# EAGLE design SD Card - Battery Board (EAGLE 6.4)

## Sheet 1 of 3: SD Card Connection
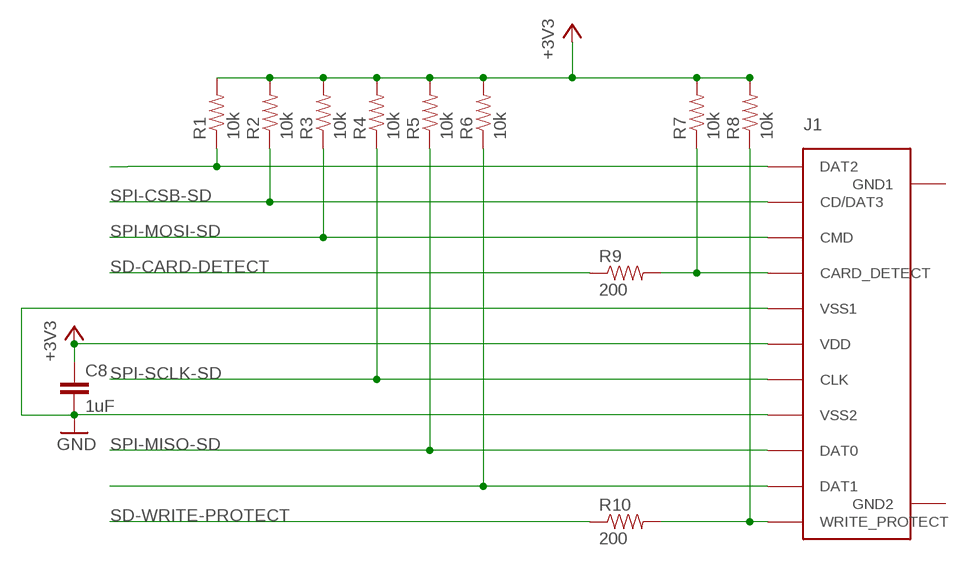
[diagram p0: schematic, sheet 1]

### Parts
C8  1uF  CAPACITOR1U-X5R-10%-10V  [C0402]
J1  SD_CARD_SLOT  [693061010911]
R1  10k  RESISTOR10K-100M-0.5%-75V  [R0603]
R2  10k  RESISTOR10K-100M-0.5%-75V  [R0603]
R3  10k  RESISTOR10K-100M-0.5%-75V  [R0603]
R4  10k  RESISTOR10K-100M-0.5%-75V  [R0603]
R5  10k  RESISTOR10K-100M-0.5%-75V  [R0603]
R6  10k  RESISTOR10K-100M-0.5%-75V  [R0603]
R7  10k  RESISTOR10K-100M-0.5%-75V  [R0603]
R8  10k  RESISTOR10K-100M-0.5%-75V  [R0603]
R9  200  RESISTOR200-100M-0.1%-75V  [R0603]
R10  200  RESISTOR200-100M-0.1%-75V  [R0603]

### Nets
+3V3: C8.1 J1.P$4(VDD) R1.2 R2.2 R3.2 R4.2 R5.2 R6.2 R7.2 R8.2 ; also sheet 2
GND: C8.2 J1.P$3(VSS1) J1.P$6(VSS2) ; also sheet 2,3
N$16: J1.P$9(DAT2) R1.1
N$19: J1.P$10(CARD_DETECT) R7.1 R9.2
N$25: J1.P$8(DAT1) R6.1
N$26: J1.P$11(WRITE_PROTECT) R8.1 R10.2
SD-CARD-DETECT: R9.1
SD-WRITE-PROTECT: R10.1
SPI-CSB-SD: J1.P$1(CD/DAT3) R2.1
SPI-MISO-SD: J1.P$7(DAT0) R5.1 ; also sheet 3
SPI-MOSI-SD: J1.P$2(CMD) R3.1 ; also sheet 3
SPI-SCLK-SD: J1.P$5(CLK) R4.1 ; also sheet 3
Unconnected: J1.P$12(GND1) J1.P$13(GND2)

## Sheet 2 of 3: Battery Monitoring
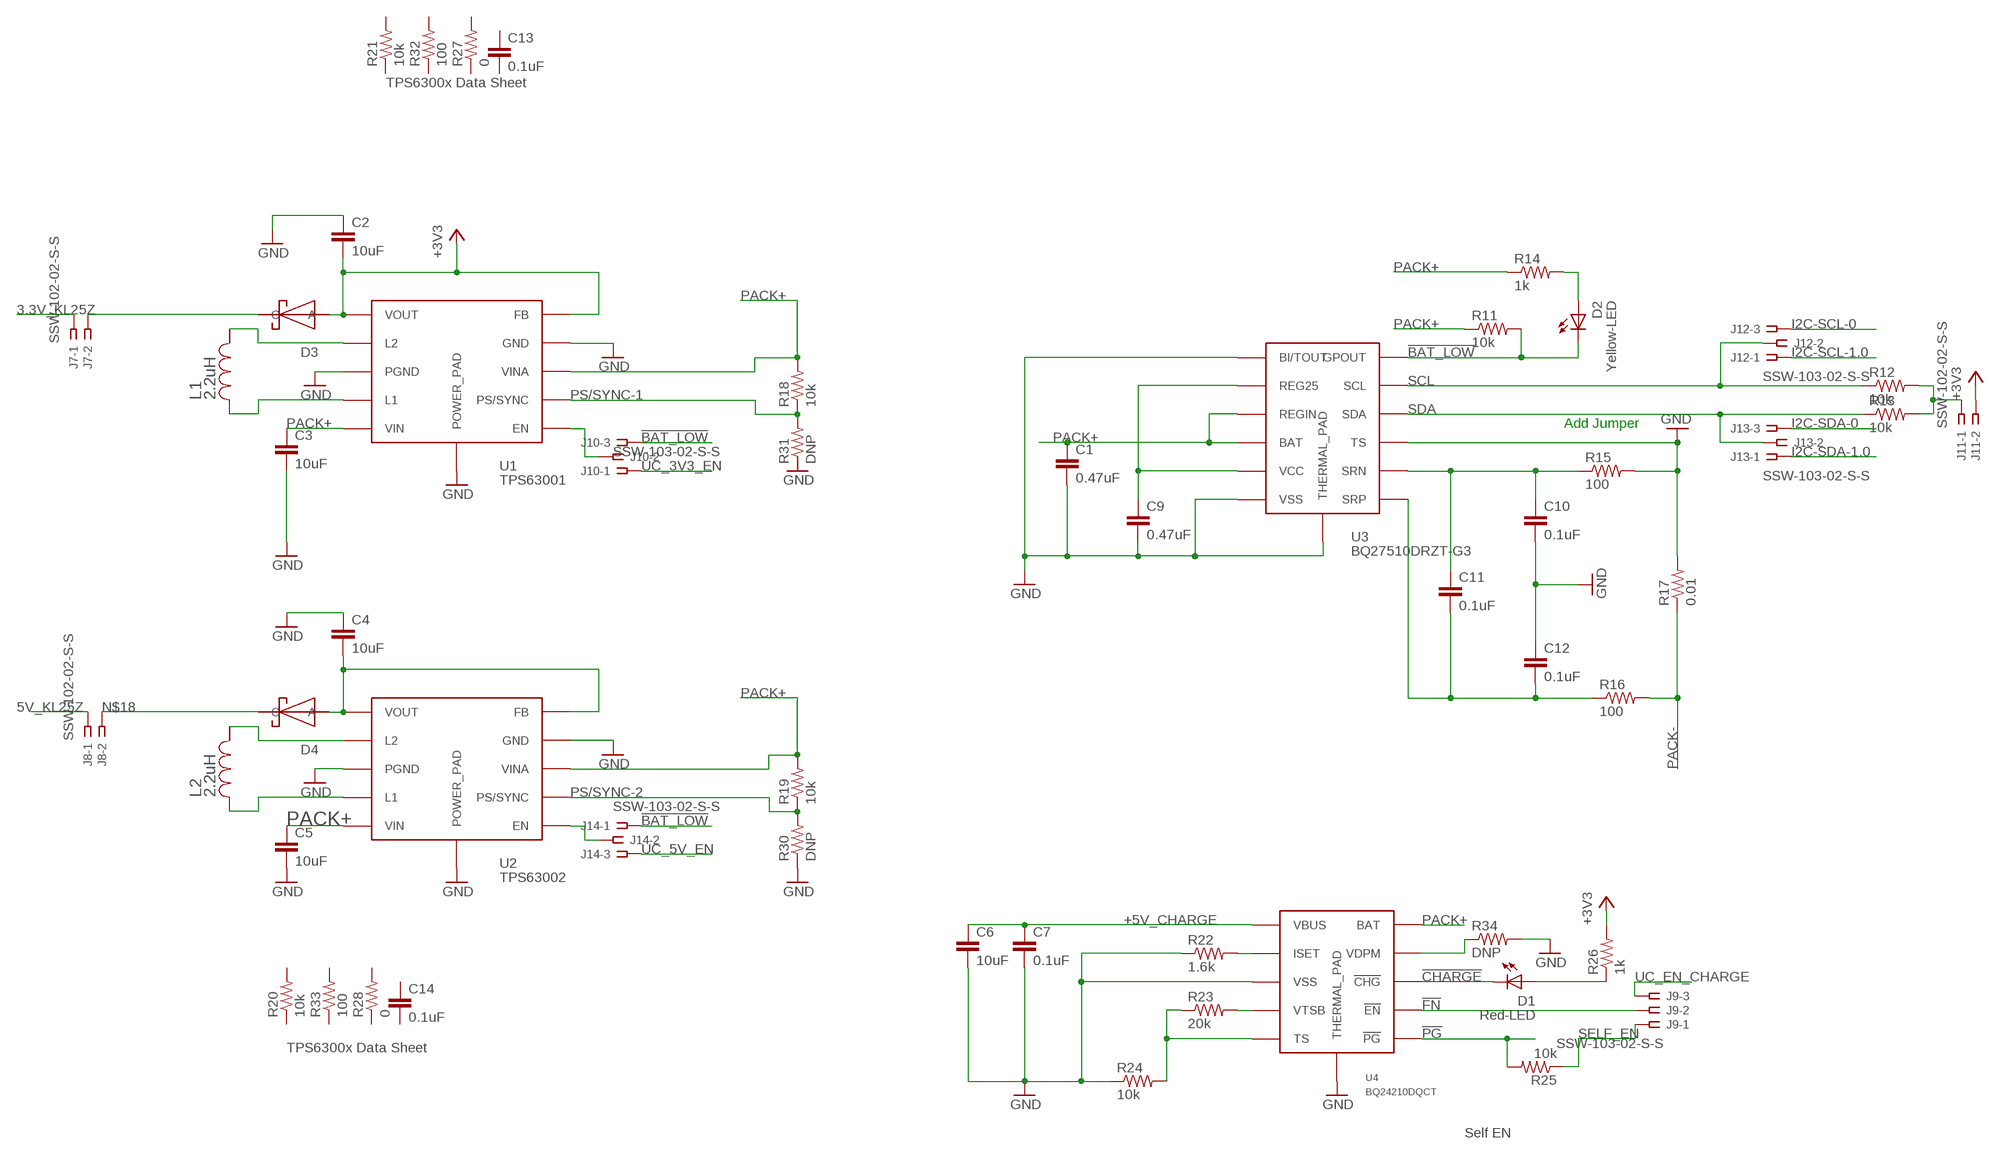
[diagram p1: schematic, sheet 2]

### Parts
C1  0.47uF  CAPACITOR0.47U-X5R-10%-6.3V-0402  [C0402]
C2  10uF  CAPACITOR10U-X5R-20%-6.3V-0402  [C0402]
C3  10uF  CAPACITOR10U-X5R-20%-6.3V-0402  [C0402]
C4  10uF  CAPACITOR10U-X5R-20%-6.3V-0402  [C0402]
C5  10uF  CAPACITOR10U-X5R-20%-6.3V-0402  [C0402]
C6  10uF  CAPACITOR10U-X5R-20%-6.3V-0402  [C0402]
C7  0.1uF  CAPACITOR0.1U-X7R-10%-25V  [C0402]
C9  0.47uF  CAPACITOR0.47U-X5R-10%-6.3V-0402  [C0402]
C10  0.1uF  CAPACITOR0.1-X5R-10%-16V-0402  [C0402]
C11  0.1uF  CAPACITOR0.1-X5R-10%-16V-0402  [C0402]
C12  0.1uF  CAPACITOR0.1-X5R-10%-16V-0402  [C0402]
C13  0.1uF  CAPACITOR0.1U-X7R-10%-25V  [C0402]
C14  0.1uF  CAPACITOR0.1U-X7R-10%-25V  [C0402]
D1  Red-LED  0.8X1.2BLUE-3.3V-20M  [0.8X1.2]
D2  Yellow-LED  0.8X1.2GREEN-3.3V-20M  [0.8X1.2]
D3  SCHOTTKY  [SC-90]
D4  SCHOTTKY  [SC-90]
J7  SSW-102-02-S-S  [SSW-102-02-S-S]
J8  SSW-102-02-S-S  [SSW-102-02-S-S]
J9  SSW-103-02-S-S  [SSW-103-02-S-S]
J10  SSW-103-02-S-S  [SSW-103-02-S-S]
J11  SSW-102-02-S-S  [SSW-102-02-S-S]
J12  SSW-103-02-S-S  [SSW-103-02-S-S]
J13  SSW-103-02-S-S  [SSW-103-02-S-S]
J14  SSW-103-02-S-S  [SSW-103-02-S-S]
L1  2.2uH  TY0NRS4010T2R2MDGG  [NRS401X]
L2  2.2uH  TY0NRS4010T2R2MDGG  [NRS401X]
R11  10k  RESISTOR10K-62.5M-1%-50V  [R0402]
R12  10k  RESISTOR10K-62.5M-1%-50V  [R0402]
R13  10k  RESISTOR10K-62.5M-1%-50V  [R0402]
R14  1k  RESISTOR1K-63M-1%-50V-0402  [R0402]
R15  100  RESISTOR1K-63M-1%-50V-0402  [R0402]
R16  100  RESISTOR1K-63M-1%-50V-0402  [R0402]
R17  0.01  RESISTOR0.01-100M-1%-50V  [R0603]
R18  10k  RESISTOR10K-62.5M-1%-50V  [R0402]
R19  10k  RESISTOR10K-62.5M-1%-50V  [R0402]
R20  10k  RESISTOR10K-62.5M-1%-50V  [R0402]
R21  10k  RESISTOR10K-62.5M-1%-50V  [R0402]
R22  1.6k  RESISTOR1.6K-63M-1%-50V-0402  [R0402]
R23  20k  RESISTOR20K-63M-1%-50V-0402  [R0402]
R24  10k  RESISTOR10K-62.5M-1%-50V  [R0402]
R25  10k  RESISTOR10K-62.5M-1%-50V  [R0402]
R26  1k  RESISTOR1K-63M-1%-50V-0402  [R0402]
R27  0  RESISTOR0-100M-X%-50V  [R0402]
R28  0  RESISTOR0-100M-X%-50V  [R0402]
R30  DNP  RESISTOR0402  [R0402]
R31  DNP  RESISTOR0402  [R0402]
R32  100  RESISTOR1K-63M-1%-50V-0402  [R0402]
R33  100  RESISTOR1K-63M-1%-50V-0402  [R0402]
R34  DNP  RESISTOR0402  [R0402]
U1  TPS63001  TPS6300XTPS63001  [VFDFN-10]
U2  TPS63002  TPS6300XTPS63002  [VFDFN-10]
U3  BQ27510DRZT-G3  BQ27510-G3  [VFDFN-12]
U4  BQ24210DQCT  B224210  [WFDFN-10]

### Nets
3.3V_KL25Z: J7.1 ; also sheet 3
5V_KL25Z: J8.1 ; also sheet 3
!BAT_LOW: D2.P$2(C) J10.3 J14.1 R11.2 U3.P$12(GPOUT)
!CHARGE: D1.P$2(C) U4.P$8(!CHG)
!FN: J9.2 U4.P$7(!EN)
!PG: R25.2 U4.P$6(!PG)
+3V3: C2.2 D3.P$2(A) J11.2 R26.2 U1.P$1(VOUT) U1.P$10(FB) ; also sheet 1
+5V_CHARGE: C6.1 C7.1 U4.P$1(VBUS) ; also sheet 3
GND: C1.2 C2.1 C3.2 C4.1 C5.2 C6.2 C7.2 C9.2 C10.2 C12.1 R15.2 R17.2 R22.1 R24.1 R30.1 R31.1 R34.2 U1.P$3(PGND) U1.P$9(GND) U1.P$11(POWER_PAD) U2.P$3(PGND) U2.P$9(GND) U2.P$11(POWER_PAD) U3.P$1(BI/TOUT) U3.P$6(VSS) U3.P$9(TS) U3.P$13(THERMAL_PAD) U4.P$3(VSS) U4.P$11(THERMAL_PAD) ; also sheet 1,3
I2C-SCL-0: J12.3 ; also sheet 3
I2C-SCL-1.0: J12.1 ; also sheet 3
I2C-SDA-0: J13.3 ; also sheet 3
I2C-SDA-1.0: J13.1 ; also sheet 3
N$1: C9.1 U3.P$2(REG25) U3.P$5(VCC)
N$2: J10.2 U1.P$6(EN)
N$3: R34.1 U4.P$9(VDPM)
N$4: J11.1 R12.2 R13.2
N$5: D2.P$1(A) R14.2
N$6: C11.2 C12.2 R16.1 U3.P$7(SRP)
N$7: C10.1 C11.1 R15.1 U3.P$8(SRN)
N$8: L1.P$1 U1.P$2(L2)
N$9: L1.P$2 U1.P$4(L1)
N$10: D1.P$1(A) R26.1
N$13: J14.2 U2.P$6(EN)
N$14: L2.P$1 U2.P$2(L2)
N$15: L2.P$2 U2.P$4(L1)
N$17: D3.P$1(C) J7.2
N$18: D4.P$1(C) J8.2
N$20: C4.2 D4.P$2(A) U2.P$1(VOUT) U2.P$10(FB)
N$31: R22.2 U4.P$2(ISET)
N$32: R23.2 U4.P$4(VTSB)
N$33: R23.1 R24.2 U4.P$5(TS)
PACK+: C1.1 C3.1 C5.1 R11.1 R14.1 R18.2 R19.2 U1.P$5(VIN) U1.P$8(VINA) U2.P$5(VIN) U2.P$8(VINA) U3.P$3(REGIN) U3.P$4(BAT) U4.P$10(BAT) ; also sheet 3
PACK-: R16.2 R17.1 ; also sheet 3
PS/SYNC-1: R18.1 R31.2 U1.P$7(PS/SYNC)
PS/SYNC-2: R19.1 R30.2 U2.P$7(PS/SYNC)
SCL: J12.2 R12.1 U3.P$11(SCL)
SDA: J13.2 R13.1 U3.P$10(SDA)
SELF_EN: J9.1 R25.1
UC_3V3_EN: J10.1
UC_5V_EN: J14.3
UC_EN_CHARGE: J9.3
Unconnected: C13.1 C13.2 C14.1 C14.2 R20.1 R20.2 R21.1 R21.2 R27.1 R27.2 R28.1 R28.2 R32.1 R32.2 R33.1 R33.2

### Notes on the sheet
- TPS6300x Data Sheet
- Add Jumper
- TPS6300x Data Sheet
- Self EN

## Sheet 3 of 3: Connectors
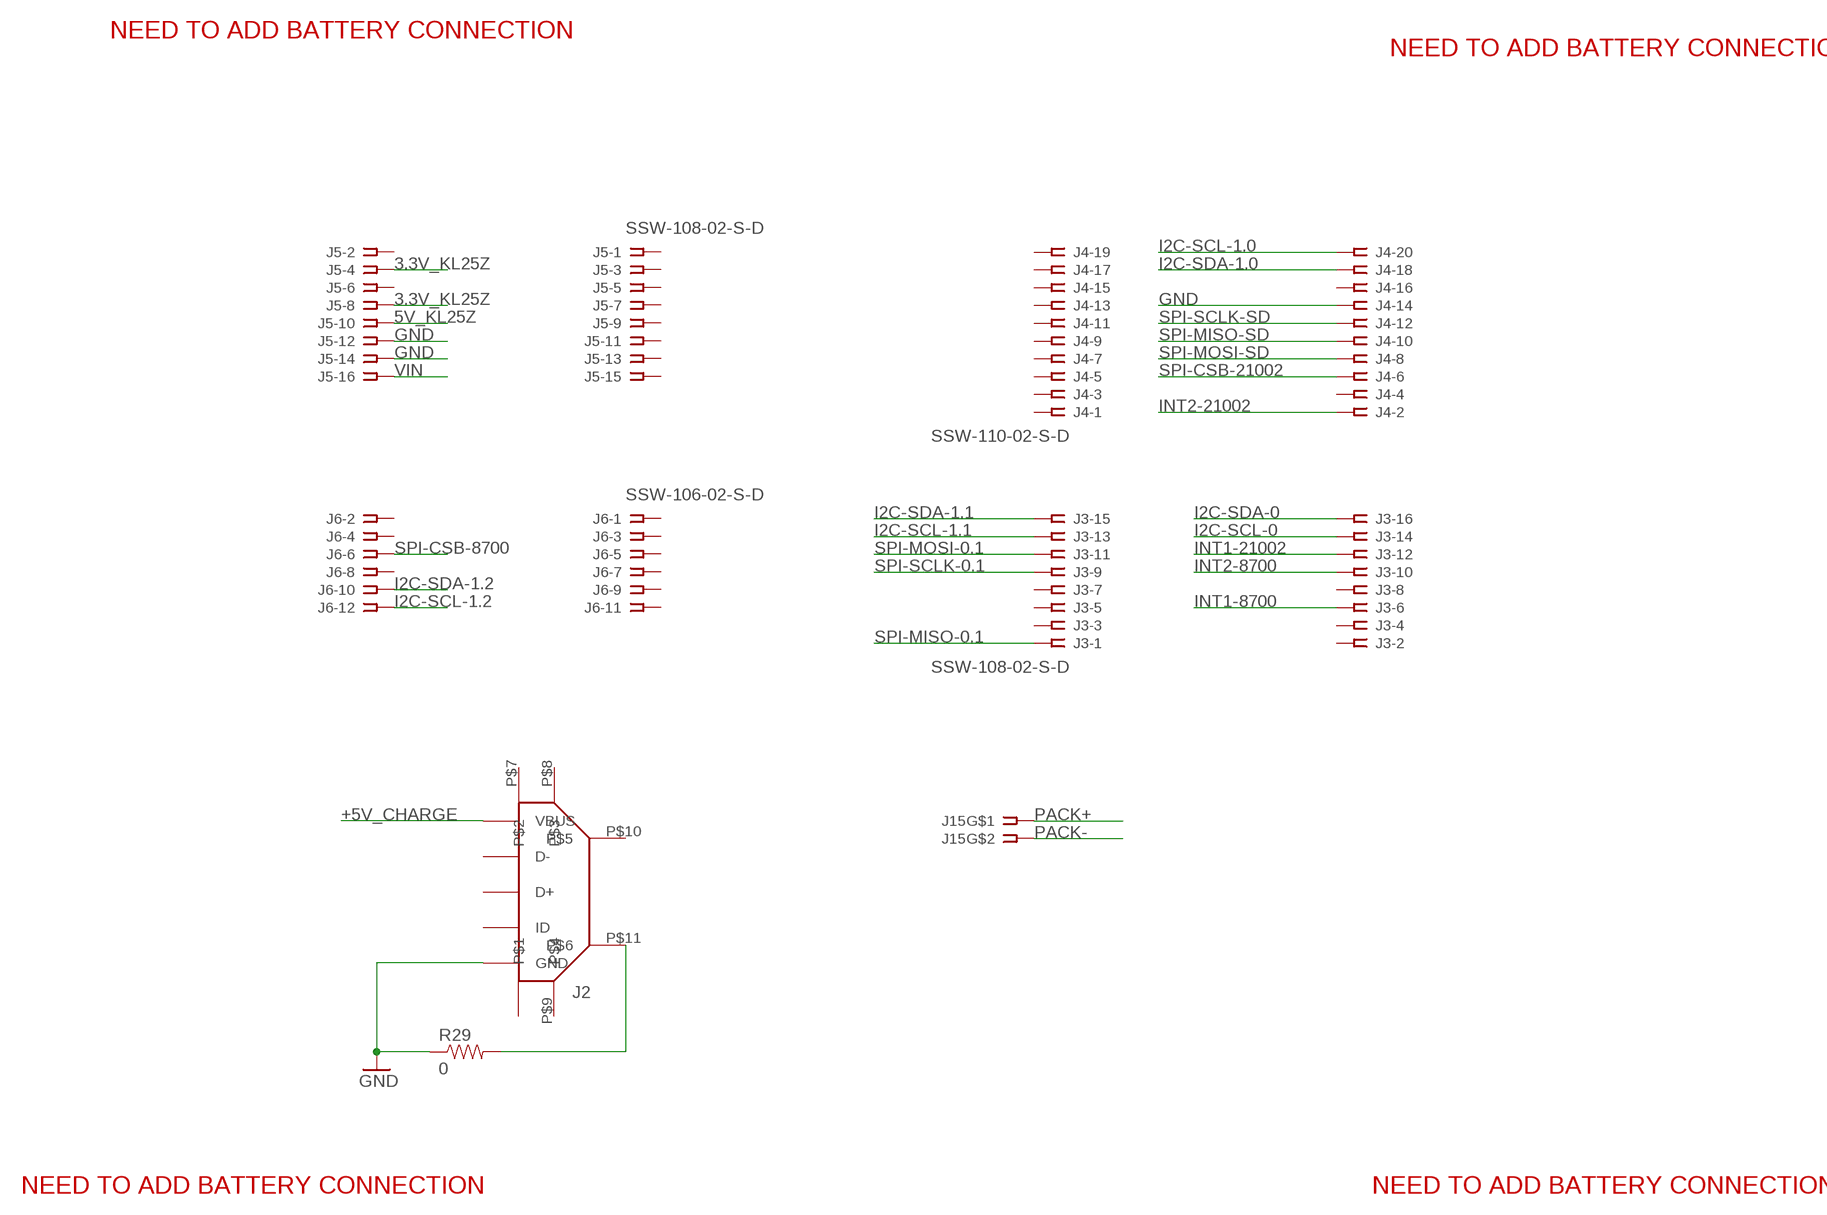
[diagram p2: schematic, sheet 3]

### Parts
J2  USB-MICROSD-47346-001  [SD47346-001-USB-MICRO-MOLEX]
J3  SSW-108-02-S-D  [SSW-108-02-S-D]
J4  SSW-110-02-S-D  [SSW-110-02-S-D]
J5  SSW-108-02-S-D  [SSW-108-02-S-D]
J6  SSW-106-02-S-D  [SSW-106-02-S-D]
J15  501568-0207-V2  [50156-0207]
R29  0  RESISTOR0-100M-X%-50V  [R0402]

### Nets
3.3V_KL25Z: J5.4 J5.8 ; also sheet 2
5V_KL25Z: J5.10 ; also sheet 2
+5V_CHARGE: J2.P$1(VBUS) ; also sheet 2
GND: J2.P$5(GND) J4.14 J5.12 J5.14 R29.1 ; also sheet 1,2
I2C-SCL-0: J3.14 ; also sheet 2
I2C-SCL-1.0: J4.20 ; also sheet 2
I2C-SCL-1.1: J3.13
I2C-SCL-1.2: J6.12
I2C-SDA-0: J3.16 ; also sheet 2
I2C-SDA-1.0: J4.18 ; also sheet 2
I2C-SDA-1.1: J3.15
I2C-SDA-1.2: J6.10
INT1-8700: J3.6
INT1-21002: J3.12
INT2-8700: J3.10
INT2-21002: J4.2
N$28: J2.P$11 R29.2
PACK+: J15.P$1 ; also sheet 2
PACK-: J15.P$2 ; also sheet 2
SPI-CSB-8700: J6.6
SPI-CSB-21002: J4.6
SPI-MISO-0.1: J3.1
SPI-MISO-SD: J4.10 ; also sheet 1
SPI-MOSI-0.1: J3.11
SPI-MOSI-SD: J4.8 ; also sheet 1
SPI-SCLK-0.1: J3.9
SPI-SCLK-SD: J4.12 ; also sheet 1
VIN: J5.16
Unconnected: J2.P$2(D-) J2.P$3(D+) J2.P$4(ID) J2.P$6 J2.P$7 J2.P$8 J2.P$9 J2.P$10 J3.2 J3.3 J3.4 J3.5 J3.7 J3.8 J4.1 J4.3 J4.4 J4.5 J4.7 J4.9 J4.11 J4.13 J4.15 J4.16 J4.17 J4.19 J5.1 J5.2 J5.3 J5.5 J5.6 J5.7 J5.9 J5.11 J5.13 J5.15 J6.1 J6.2 J6.3 J6.4 J6.5 J6.7 J6.8 J6.9 J6.11

### Notes on the sheet
- NEED TO ADD BATTERY CONNECTION
- NEED TO ADD BATTERY CONNECTION
- NEED TO ADD BATTERY CONNECTION | NEED TO ADD BATTERY CONNECTION

## Library data of the parts
C1 C9 = Kas-Capacitors:CAPACITOR: Ceramic SMT Capacitor; DIELECTRIC: X5R; MANUFACTURER: Multicomp; MANUFACTURER_PARTR_NUMBER: MC0402X474K6R3CT; NEWARK_PART_NUMBER: 06R4896; TEMPERATURE: -55 ~ 85; TOLARANCE: 10%; VOLTAGE: 6.3
C2-C6 = Kas-Capacitors:CAPACITOR: Ceramic SMT Capacitor; DIELECTRIC: X5R; MANUFACTURER: TDK; MANUFACTURER_PART_NUMBER: C1005X5R0J106M050BC; NEWARK_PART_NUMBER: 05X9827; TEMPERATURE: -55 ~ 85; TOLARANCE: 20%; VOLTAGE: 6.3
C7 C13 C14 = Kas-Capacitors:CAPACITOR: Ceramic SMT Capacitor; DIELECTRIC: X7R; MANUFACTURER: TDK; MANUFACTURER_PART_NUMBER: CGA2B3X7R1E104K050BB; NEWARK_PART_NUMBER: 04X3147; TEMPERATURE: -55 ~ 125; TOLARANCE: 10%; VOLTAGE: 25
C8 = Kas-Capacitors:CAPACITOR: Ceramic SMT Capacitor; DIELECTRIC: X5R; MANUFACTURER: Johanson Dielectrics Inc.; MANUFACTURER_PART_NUMBER: 100R07X105KV4T; NEWARK_PART_NUMBER: 41T2953; TEMPERATURE: -55 ~ 85; TOLARANCE: 10%; VOLTAGE: 10
C10-C12 = Kas-Capacitors:CAPACITOR: Ceramic SMT Capacitor; DIELECTRIC: X5R; MANUFACTURER: Multicomp; MANUFACTURER_PART_NUMBER: MC0402X104K160CT; NEWARK_PART_NUMBER: 06R4871; TEMPERATURE: -55 ~ 85; TOLARANCE: 10%; VOLTAGE: 16
D1 = Kas-Diodes-LEDs:0.8X1.2; COLOR: Blue; FORWARD_CURRENT: 20mA; FORWARD_VOLTAGE: 3.3; LUMINOUS_INTENSITY: 95cmd; MANUFACTURER: Kingbright; MANUFACTURER_PART_NUMBER: KPG-1608QBC-E; NEWARK_PART_NUMBER: 56P5113; VIEWING_ANGLE: 120; WAVELENGTH: 470nm
D2 = Kas-Diodes-LEDs:0.8X1.2; COLOR: Green; FORWARD_CURRENT: 20mA; FORWARD_VOLTAGE: 3.3; LUMINOUS_INTENSITY: 420mcd; MANUFACTURER: Kingbright; MANUFACTURER_PART_NUMBER: KPG-1608ZGC; NEWARK_PART_NUMBER: 56P5117; VIEWING_ANGLE: 120; WAVELENGTH: 525nm
D3 D4 = Kas-Diodes-LEDs:SCHOTTKY; MANUFACTURER: NXP; MANUFACTURER_PART_NUMBER: PMEG2020EJ; NEWARK_PART_NUMBER: 75R0865
J1 = Kas-Connectors:SD_CARD_SLOT; #_PINS: 11; #_ROWS: 1; MANUFACTURER: Wurth Electronik; MANUFACTURER_PART_NUMBER: 693061010911; NEWARK_PART_NUMBER: 89T9349
J2 = Kas-Connectors:USB-MICRO; #_PINS: 5; #_ROWS: 1; MANUFACTURER: Molex; MANUFACTURER_PART_NUMBER: SD-47346-001; NEWARK_PART_NUMBER: 47M0505
J3 J5 = Kas-Connectors:SSW-108-02-S-D: THROUGH-HOLE .025" SQ POST SOCKET Source: Samtec SSW.pdf; MPN: SSW-108-02-S-D; OC_FARNELL: unknown; OC_NEWARK: 85K7646
J4 = Kas-Connectors:SSW-110-02-S-D: THROUGH-HOLE .025" SQ POST SOCKET Source: Samtec SSW.pdf; MPN: SSW-110-02-S-D; OC_FARNELL: unknown; OC_NEWARK: 11P9480
J6 = Kas-Connectors:SSW-106-02-S-D: THROUGH-HOLE .025" SQ POST SOCKET Source: Samtec SSW.pdf; MPN: SSW-106-02-S-D; OC_FARNELL: unknown; OC_NEWARK: 11P9414
J7 J8 J11 = Kas-Connectors:SSW-102-02-S-S: THROUGH-HOLE .025" SQ POST SOCKET Source: Samtec SSW.pdf; MPN: SSW-102-02-S-S; OC_FARNELL: unknown; OC_NEWARK: 11P9351
J9 J10 J12-J14 = Kas-Connectors:SSW-103-02-S-S: THROUGH-HOLE .025" SQ POST SOCKET Source: Samtec SSW.pdf; MPN: SSW-103-02-S-S; OC_FARNELL: unknown; OC_NEWARK: 11P9367
J15 = Kas-Connectors:501568-0207-V2: 1.00mm Pitch Pico-Clasp™ Wire-to-Board Header, Surface Mount, Single Row, Right Angle, with Friction Lock, 2 Circuits; #_PINS: 2; #_ROWS: 1; MANUFACTURER: Molex; MANUFACTURER_PAR_NUMBER: 501568-0207
L1 L2 = Kas-Inductors:TY0NRS4010T2R2MDGG; CONSTRUCTION: Shielded; CURRENT_RATING: 1.5; MANUFACTURER: Taiyo Yuden; MANUFACTURER_PART_NUMBER: NRS4010T2R2MDGG; NEWARK_PART_NUMBER: 46T8541; SATURATION_CURRENT: 1.2; SELF_RESONANCE: 73MHz; TOLARANCE: 20%
R1-R8 = Kas-Resistors:RESISTOR: 0402 Resistor; MANUFACTURER: Visay; MANUFACTURER_PART_NUMBER: TNPW060310K0DEEA; NEWARK_PART_NUMBER: 84R1889; POWER_RATING: 100mW; TEMPERATURE_COEFFICIENT: 25ppm; TOLARANCE: 0.5%; VOLTAGE: 75
R9 R10 = Kas-Resistors:RESISTOR: 0402 Resistor; MANUFACTURER: PANASONIC ELECTRONIC COMPONENTS; MANUFACTURER_PART_NUMBER: ERA-3AEB201V; NEWARK_PART_NUMBER: 39P9961; POWER_RATING: 100mW; TEMPERATURE_COEFFICIENT: 25ppm; TOLARANCE: 0.1%; VOLTAGE: 75
R11-R13 R18-R21 R24 R25 = Kas-Resistors:RESISTOR: 0402 Resistor; MANUFACTURER: Yageo; MANUFACTURER_PART_NUMBER: RC0402FR-0710KL; NEWARK_PART_NUMBER: 67R9884; TEMPERATURE_COEFFICIENT: 100ppm/C; TOLARANCE: 1%; VOLTAGE: 50
R14 R26 = Kas-Resistors:RESISTOR: 0402 Resistor; MANUFACTURER: TE Connectivity; MANUFACTURER_PART_NUMBER: CRG0402F1K0; NEWARK_PART_NUMBER: 95W7398; POWER_RATING: 63mW; TEMPERATURE_COEFFICIENT: 100ppm; TOLARANCE: 1%; VOLTAGE: 50
R15 R16 R32 R33 = Kas-Resistors:RESISTOR: 0402 Resistor; MANUFACTURER: TE Connectivity; MANUFACTURER_PART_NUMBER: CRG0402F1K0; NEWARK_PART_NUMBER: 95W7398; POWER_RATING: 63mW; TEMPERATURE_COEFFICIENT: 100ppm; TOLARANCE: 1%; VALUE: 1k; VOLTAGE: 50
R17 = Kas-Resistors:RESISTOR: 0402 Resistor; MANUFACTURER: Yageo; MANUFACTURER_PART_NUMBER: RL0603FR-070R01L; NEWARK_PART_NUMBER: 39K1663; POWER_RATING: 100mW; TEMPERATURE_COEFFICIENT: 1500ppm; TOLARANCE: 1%; VOLTAGE: 50
R22 = Kas-Resistors:RESISTOR: 0402 Resistor; MANUFACTURER: TE Connectivity; MANUFACTURER_PART_NUMBER: CRG0402F1K6; NEWARK_PART_NUMBER: 95W7403; POWER_RATING: 63mW; TEMPERATURE_COEFFICIENT: 100ppm; TOLARANCE: 1%; VOLTAGE: 50
R23 = Kas-Resistors:RESISTOR: 0402 Resistor; MANUFACTURER: TE Connectivity; MANUFACTURER_PART_NUMBER: CRG0402F20K; NEWARK_PART_NUMBER: 95W7439; POWER_RATING: 63mW; TEMPERATURE_COEFFICIENT: 100ppm; TOLARANCE: 1%; VOLTAGE: 50
R27-R29 = Kas-Resistors:RESISTOR: 0402 Resistor; MANUFACTURER: PANASONIC ELECTRONIC COMPONENTS; MANUFACTURER_PART_NUMBER: ERJ-U020R00X; NEWARK_PART_NUMBER: 51W3639; TEMPERATURE_COEFFICIENT: 200ppm/C; TOLARANCE: 1%; VOLTAGE: 50
R30 R31 R34 = Kas-Resistors:RESISTOR: 0402 Resistor
U1 = Kas-Buck Boost Battery Control:TPS6300X; INPUT_VOLTAGE: 1.8 - 5.5; MANUFACTURER: Texas Instuments; MANUFACTURER_PART_NUMBER: TPS63001DRCR; NEWARK_PART_NUMBER: 85K1711; OUTPUT_CURRENT: 1.2A; OUTPUT_VOLTAGE: 3.3; SWITCHING_FREQUENCY: 1.5MHz; TEMPERATURE: -40~ 85; TOPOLOGY: Switching
U2 = Kas-Buck Boost Battery Control:TPS6300X; INPUT_VOLTAGE: 1.8 ~ 5.5; MANUFACTURER: Texas Instuments; MANUFACTURER_PART_NUMBER: TPS63002DRCR; NEWARK_PART_NUMBER: 85K1713; OUTPUT_CURRENT: 1.8A; OUTPUT_VOLTAGE: 5; SWITCHING_FREQUENCY: 1.5MHz; TEMPERATURE: -40 ~ 85; TOPOLOGY: Switching
U3 = Kas-Buck Boost Battery Control:BQ27510-G3; INPUT_VOLTAGE: 2.7 - 5.5; MANUFACTURER: Texas Instruments; MANUFACTURER_PART_NUMBER: BQ27510DRZT-G3; NEWARK_PART_NUMBER: 73W9727; TEMPERATURE: -40 ~ 85; VALUE: BQ27510-G3
U4 = Kas-Buck Boost Battery Control:B224210; BATTERY_CHARGE_VOLTAGE: 4.2; CHARGE_CURRENT_MAX: 800mA; INPUT_VOLTAGE: 7; MANUFACTURER: Texas Instruments; MANUFACTURER_PART_NUMBER: BQ24210DQCT; NEWARK_PART_NUMBER: 56T0491; TEMPERATURE: -40 ~ 85; VALUE: BQ24210

## Board
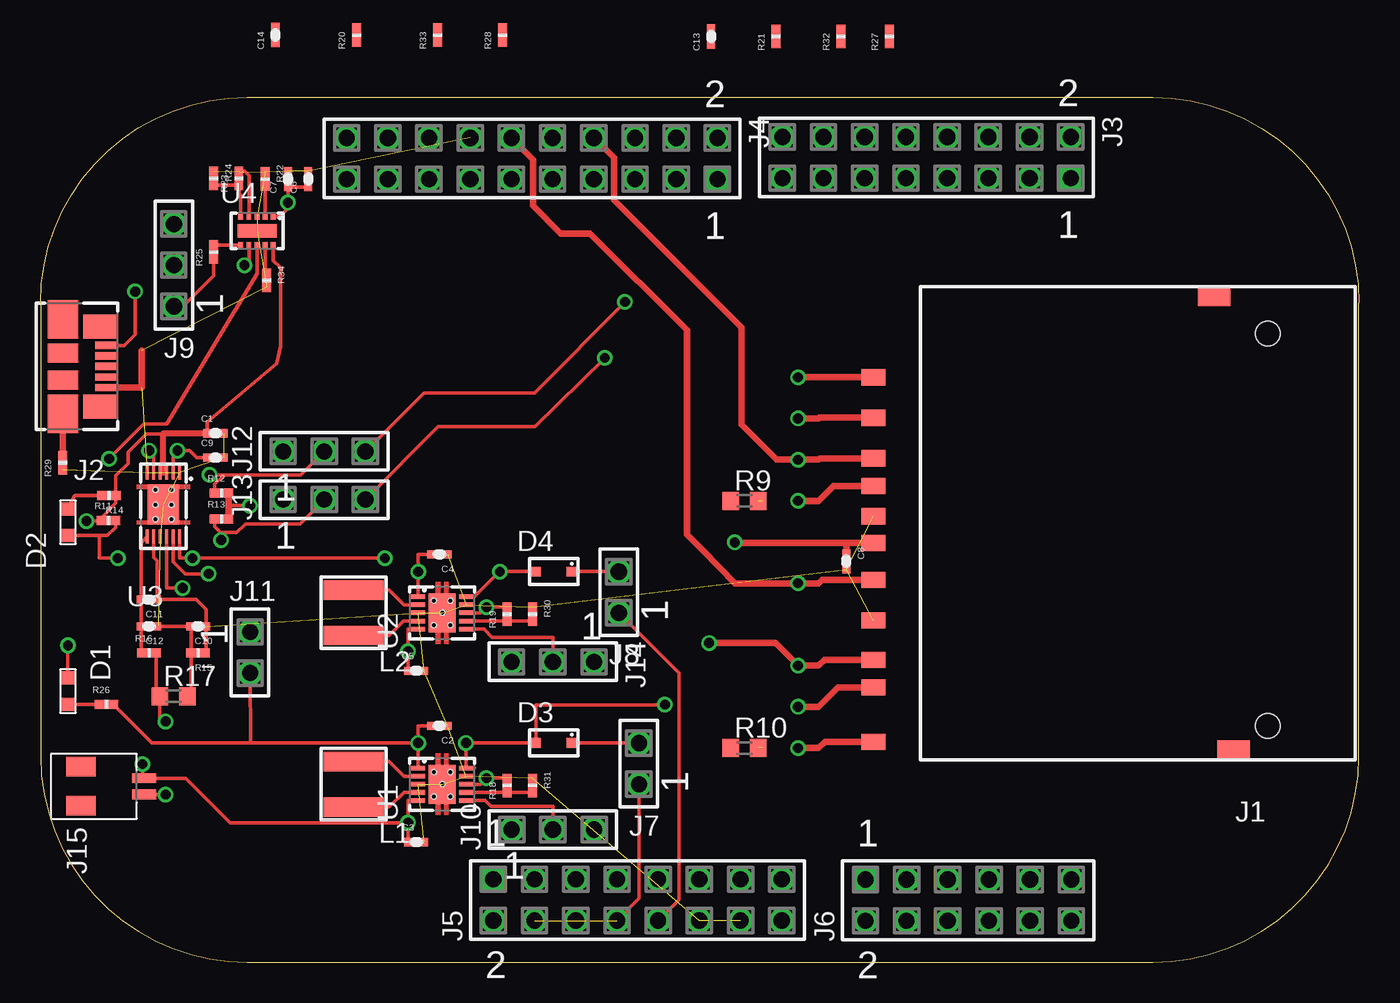
[diagram p3: board, top side]
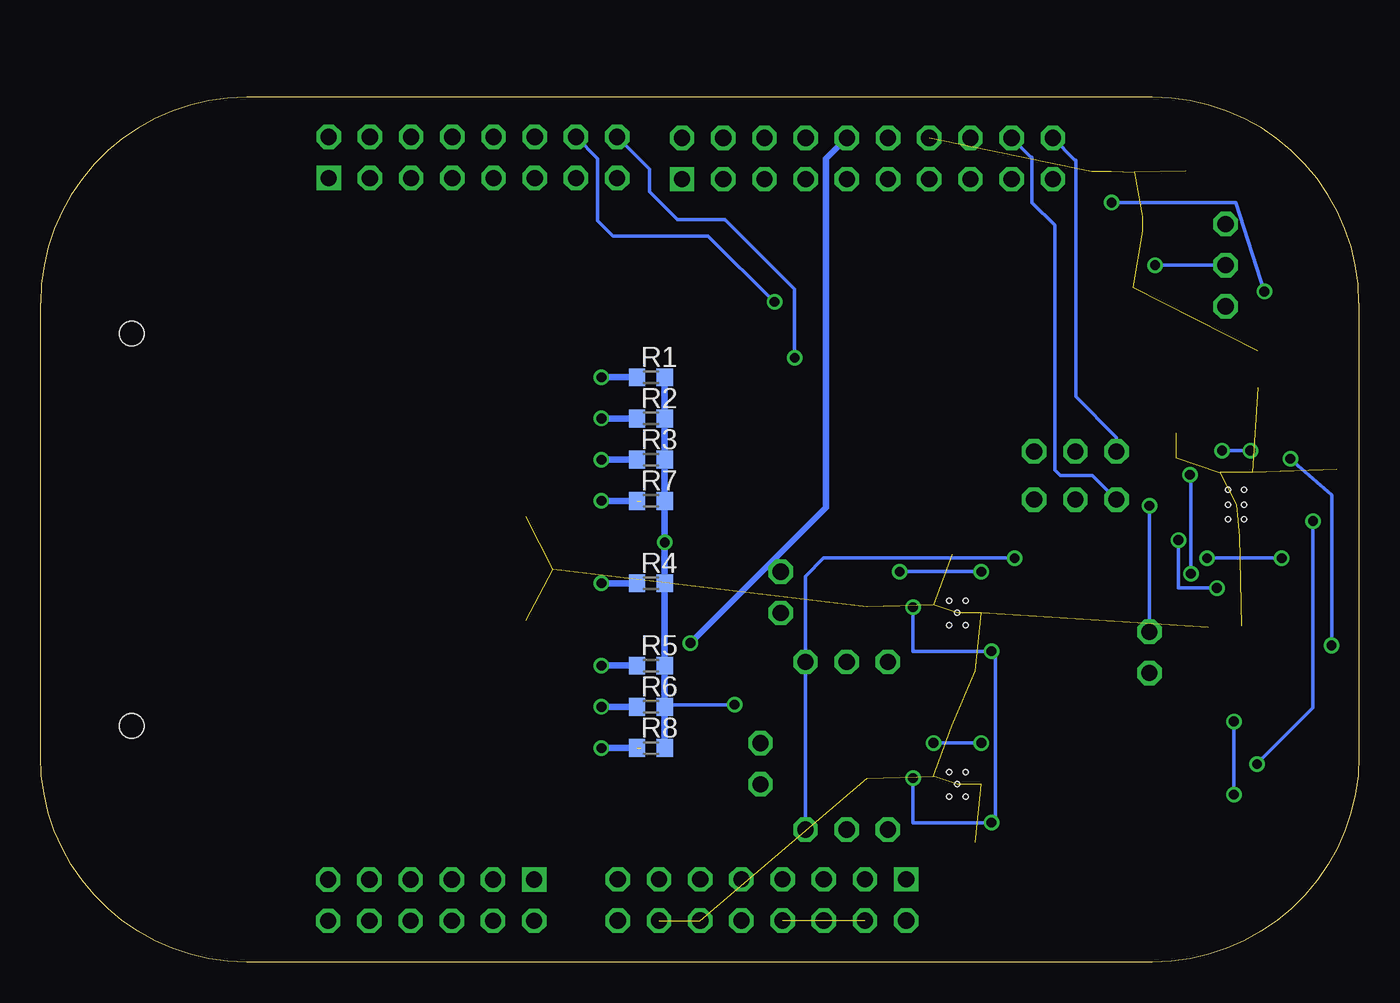
[diagram p4: board, bottom side, seen from below]

Size 81.28 x 53.34 mm. Coordinates in mm from the lower left corner, seen from the top.
Outline: 12.74,0 68.58,0 arc90 81.28,12.7 81.28,40.64 arc90 68.58,53.34 12.72,53.34 arc90 0,40.64 0,12.7 arc90 12.74,0
Copper layers (1*16): Top 0.0356mm / dielectric 1.5011mm / Bottom 0.0356mm
Design rules "LaenPCBOrder": minimum track width 6mil, minimum drill 13mil, track to track 6mil, track to pad 6mil, pad to pad 6mil, via to via 6mil, smd to smd 6mil, copper to edge 15mil, drill to drill 6mil, minimum pad ring 7mil, minimum via ring 7mil, stop-mask expansion 3mil, vias tented up to drill 0mil, thermal gap 10mil

### Footprints (pad centres in the part's own frame; a part is rotated, then mirrored left to right if it is on the bottom)
C0402 = smd 0.5 x 0.5: 1 -0.5,0; 2 0.5,0
0.8X1.2 = smd 0.8 x 0.8: P$1 -0.825,0; P$2 0.825,0
SC-90 = smd 0.6 x 0.6: P$1 -1.1,0; P$2 1.1,0
693061010911 = smd 1.5 x 1: P$1 -24.31,6.9; P$2 -24.31,4.4; P$3 -24.31,0.825; P$4 -24.31,-0.825; P$5 -24.31,-3.1; P$6 -24.31,-5.6; P$7 -24.31,-8.03; P$8 -24.31,-9.73; P$9 -24.31,9.4; P$10 -24.31,2.7; P$11 -24.31,-13.08 | smd 2 x 1.2: P$12 -2.1,-13.6; P$13 -3.3,14.4 | hole 1.5: 0,12.1; 0,-12.1
SD47346-001-USB-MICRO-MOLEX = smd 1.38 x 0.45: P$1 0,1.3; P$2 0,0.65; P$3 0,0; P$4 0,-0.65; P$5 0,-1.3 | smd 2.1 x 1.475: P$6 -0.36,-2.462; P$7 -0.36,2.462 | smd 1.9 x 2.375: P$8 -2.66,2.913; P$11 -2.66,-2.913 | smd 1.9 x 1.175: P$9 -2.66,0.838; P$10 -2.66,-0.838
SSW-108-02-S-D = drill 1 pad 1.5 square: 1 -8.89,1.27 | drill 1 pad 1.5 octagon: 2 -8.89,-1.27; 3 -6.35,1.27; 4 -6.35,-1.27; 5 -3.81,1.27; 6 -3.81,-1.27; 7 -1.27,1.27; 8 -1.27,-1.27; 9 1.27,1.27; 10 1.27,-1.27; 11 3.81,1.27; 12 3.81,-1.27; 13 6.35,1.27; 14 6.35,-1.27; 15 8.89,1.27; 16 8.89,-1.27
SSW-110-02-S-D = drill 1 pad 1.5 square: 1 -11.43,1.27 | drill 1 pad 1.5 octagon: 2 -11.43,-1.27; 3 -8.89,1.27; 4 -8.89,-1.27; 5 -6.35,1.27; 6 -6.35,-1.27; 7 -3.81,1.27; 8 -3.81,-1.27; 9 -1.27,1.27; 10 -1.27,-1.27; 11 1.27,1.27; 12 1.27,-1.27; 13 3.81,1.27; 14 3.81,-1.27; 15 6.35,1.27; 16 6.35,-1.27; 17 8.89,1.27; 18 8.89,-1.27; 19 11.43,1.27; 20 11.43,-1.27
SSW-106-02-S-D = drill 1 pad 1.5 square: 1 -6.35,1.27 | drill 1 pad 1.5 octagon: 2 -6.35,-1.27; 3 -3.81,1.27; 4 -3.81,-1.27; 5 -1.27,1.27; 6 -1.27,-1.27; 7 1.27,1.27; 8 1.27,-1.27; 9 3.81,1.27; 10 3.81,-1.27; 11 6.35,1.27; 12 6.35,-1.27
SSW-102-02-S-S = drill 1 pad 1.5 octagon: 1 -1.27,0; 2 1.27,0
SSW-103-02-S-S = drill 1 pad 1.5 octagon: 1 -2.54,0; 2 0,0; 3 2.54,0
50156-0207 = smd 0.6 x 1.5: P$1 -0.5,4.8; P$2 0.5,4.8 | smd 1.2 x 1.8: P$3 -1.2,0.9; P$4 1.2,0.9
NRS401X = smd 3.7 x 1.2: P$1 0,1.4; P$2 0,-1.4
R0603 = smd 1 x 1.1: 1 -0.85,0; 2 0.85,0
R0402 = smd 0.6 x 0.55: 1 -0.425,0; 2 0.425,0
VFDFN-10 = smd 0.28 x 0.85: P$1 -1,-1.475; P$2 -0.5,-1.475; P$3 0,-1.475; P$4 0.5,-1.475; P$5 1,-1.475; P$6 1,1.475; P$7 0.5,1.475; P$8 0,1.475; P$9 -0.5,1.475; P$10 -1,1.475 | smd 2.4 x 1.65: P$11 0,0 | hole 0.3: 0,0; -0.75,0.5; -0.75,-0.5; 0.75,0.5; 0.75,-0.5
VFDFN-12 = smd 0.2 x 0.85: P$1 -1,-1.975; P$2 -0.6,-1.975; P$3 -0.2,-1.975; P$4 0.2,-1.975; P$5 0.6,-1.975; P$6 1,-1.975; P$7 1,1.975; P$8 0.6,1.975; P$9 0.2,1.975; P$10 -0.2,1.975; P$11 -0.6,1.975; P$12 -1,1.975 | smd 1.95 x 2.45: P$13 0,0 | hole 0.3: 0.5,0; -0.5,0; 0.5,0.9; -0.5,0.9; 0.5,-0.9; -0.5,-0.9
WFDFN-10 = smd 0.3 x 0.35: P$1 -1,-0.875; P$2 -0.5,-0.875; P$3 0,-0.875; P$4 0.5,-0.875; P$5 1,-0.875; P$6 1,0.875; P$7 0.5,0.875; P$8 0,0.875; P$9 -0.5,0.875; P$10 -1,0.875 | smd 2.4 x 0.84: P$11 0,0

### Placement (x,y rotation side)
C1  10.78,32.61 0 top
C2  24.59,14.58 180 top
C3  23.16,7.41 0 top
C4  24.59,25.15 180 top
C5  23.16,17.97 0 top
C6  16.5,48.29 90 top
C7  15.25,48.29 90 top
C8  49.68,24.71 270 top
C9  10.78,31.12 0 top
C10  9.72,20.72 180 top
C11  6.69,22.37 180 top
C12  6.69,20.72 180 top
C13  41.34,57.08 90 top  (outside the outline)
C14  14.48,57.16 90 top  (outside the outline)
D1  1.69,16.71 90 top
D2  1.69,27.13 270 top
D3  31.64,13.52 180 top
D4  31.64,24.08 180 top
J1  75.65,26.67 0 top
J2  4.05,36.73 0 top
J3  54.62,49.62 180 top
J4  30.3,49.56 180 top
J5  36.8,3.84 0 top
J6  57.2,3.82 0 top
J7  36.89,12.24 90 top
J8  35.65,22.81 90 top
J9  8.22,42.98 90 top
J10  31.58,8.18 0 top
J11  12.92,19.1 270 top
J12  17.49,31.5 0 top
J13  17.49,28.52 0 top
J14  31.58,18.52 180 top
J15  1.59,10.85 270 top
L1  19.29,10.97 0 top
L2  19.29,21.55 0 top
R1  43.65,36.07 0 bottom
R2  43.65,33.53 0 bottom
R3  43.65,30.99 0 bottom
R4  43.65,23.37 0 bottom
R5  43.65,18.29 0 bottom
R6  43.65,15.75 0 bottom
R7  43.65,28.45 0 bottom
R8  43.65,13.21 0 bottom
R9  43.4,28.45 0 top
R10  43.4,13.21 0 top
R11  4.19,27.23 0 top
R12  11.16,28.93 0 top
R13  11.16,27.33 0 top
R14  4.22,28.78 180 top
R15  9.72,19.06 180 top
R16  6.69,19.06 0 top
R17  8.2,16.4 0 top
R18  28.77,10.9 90 top
R19  28.77,21.47 90 top
R20  19.48,57.16 90 top  (outside the outline)
R21  45.34,57.08 90 top  (outside the outline)
R22  13.86,48.29 270 top
R23  12.23,48.34 90 top
R24  10.68,48.34 270 top
R25  10.68,43.79 90 top
R26  4.07,15.89 0 top
R27  52.34,57.08 90 top  (outside the outline)
R28  28.48,57.16 90 top  (outside the outline)
R29  1.36,30.8 90 top
R30  30.34,21.47 270 top
R31  30.34,10.9 270 top
R32  49.34,57.08 90 top  (outside the outline)
R33  24.48,57.16 90 top  (outside the outline)
R34  13.93,42.04 270 top
U1  24.76,10.97 270 top
U2  24.76,21.54 270 top
U3  7.57,28.22 180 top
U4  13.35,45.09 180 top

### Tracks (layer width: path | path; a pad name or v marks a point on that pad's centre or on a via)
3.3V_KL25Z  (1 unrouted)
  Top 0.203: J5.8 36.89,3.93 J7.1
5V_KL25Z
  Top 0.203: J5.10 39.36,3.85 39.36,17.83 J8.1
!BAT_LOW  (via drill 0.6)
  Top 0.203: 3.62,26.3 D2.P$2 | 3.62,26.3 3.62,24.92 v4.76,24.92 | v21.22,24.92 v9.36,24.92 8.57,24.92 U3.P$12 | 3.62,26.3 4.11,26.3 4.62,26.81 R11.2
  Bottom 0.203: v4.76,24.92 v9.36,24.92 | v21.22,24.92 33.01,24.92 34.12,23.8 J14.1 J10.3
!CHARGE  (via drill 0.6)
  Top 0.203: U4.P$8 13.35,42.47 7.78,33.17 6.35,33.17 4.23,31.05 v4.23,31.04 | v1.69,19.53 D1.P$2
  Bottom 0.203: v4.23,31.04 1.69,28.8 v1.69,19.53
!FN  (via drill 0.6)
  Top 0.203: U4.P$7 12.85,43.26 v12.56,42.98
  Bottom 0.203: v12.56,42.98 J9.2
!PG
  Top 0.203: R25.2 U4.P$6
+3V3  (via drill 0.6)
  Top 0.203: U1.P$1 v23.28,13.52 | 26.76,11.97 U1.P$10 v26.23,13.52 D3.P$2 30.54,15.88 v38.49,15.88 | 12.94,13.52 6.86,13.52 R26.2 | 12.94,13.52 v23.28,13.52 | J11.2 12.94,13.52 | v23.28,13.52 23.28,14.58 C2.2
  Top 0.406: J1.P$4 49.68,25.85 | 49.68,25.85 42.8,25.85 v42.8,25.88 | C8.1 49.68,25.85
  Bottom 0.203: v38.49,15.88 42.67,15.88 R6.2 | v23.28,13.52 v26.23,13.52
  Bottom 0.406: R1.2 R2.2 R3.2 R7.2 v42.8,25.88 R4.2 R5.2 R6.2 R8.2 42.8,13.52
+5V_CHARGE  (via drill 0.6)
  Top 0.203: C6.1 C7.1 v15.25,46.84 15.25,46.48 14.73,45.96 U4.P$1 | J2.P$1 5.15,38.03 5.83,38.71 v5.83,41.35
  Bottom 0.203: v5.83,41.35 7.58,46.84 v15.25,46.84
GND  (33 unrouted)
  Top 0.203: C12.1 7.19,20.74 7.25,20.74 7.28,20.72 C10.2 9.29,20.64 R15.2 9.29,16.63 R17.2
  Top 0.406: J2.P$5 6.24,35.43 6.24,37.71
I2C-SCL-0  (via drill 0.6)
  Top 0.203: J12.3 23.63,35.1 30.44,35.1 v36.03,40.72
  Bottom 0.203: v36.03,40.72 40.12,44.78 45.99,44.78 46.93,45.72 46.93,49.54 J3.14
I2C-SCL-1.0
  Bottom 0.203: J12.1 14.95,32.36 17.46,34.87 17.46,49.45 17.5,49.45 J4.20
I2C-SDA-0  (via drill 0.6)
  Top 0.203: J13.3 24.52,33.02 30.49,33.02 v34.78,37.26
  Bottom 0.203: J3.16 43.75,48.91 43.75,47.52 42.02,45.8 39.08,45.8 34.78,41.5 v34.78,37.26
I2C-SDA-1.0
  Bottom 0.203: J13.1 16.42,30 18.4,30 18.76,30.35 18.76,45.44 20.15,46.84 20.15,49.63 20.22,49.63 J4.18
N$1  (via drill 0.6)
  Top 0.203: U3.P$2 8.17,31.55 v8.44,31.55 9.18,31.55 9.61,31.12 C9.1 | U3.P$5 6.97,31.55 v6.69,31.55
  Bottom 0.203: v6.69,31.55 v8.44,31.55
N$2
  Top 0.203: J10.2 31.58,9.6 27.77,9.6 27.4,9.97 U1.P$6
N$3
  Top 0.203: U4.P$9 13.86,42.54 R34.1
N$4  (via drill 0.6)
  Top 0.203: 11.59,28.15 12.58,28.15 v12.92,28.14
  Top 0.406: R12.2 11.59,28.15 R13.2
  Bottom 0.203: v12.92,28.14 J11.1
N$5
  Top 0.203: R14.2 2.1,28.78 D2.P$1
N$6
  Top 0.203: U3.P$7 6.19,25.86 C11.2 C12.2 6.19,19.06 R16.1
N$7
  Top 0.203: U3.P$8 6.97,24.97 7.2,24.74 7.2,22.37 C11.1 9.59,22.37 10.22,21.74 C10.1 10.22,19.06 R15.1
N$8
  Top 0.203: U1.P$2 22.4,11.47 21.5,12.37 L1.P$1
N$9
  Top 0.203: U1.P$4 22.4,10.47 21.5,9.57 L1.P$2
N$10
  Top 0.203: D1.P$1 1.94,15.89 R26.1
N$13
  Top 0.203: J14.2 31.58,20.04 27.85,20.04 27.35,20.54 U2.P$6
N$14
  Top 0.203: L2.P$1 21.49,22.95 22.4,22.04 U2.P$2
N$15
  Top 0.203: L2.P$2 21.48,20.15 22.37,21.04 U2.P$4
N$16  (via drill 0.6)
  Top 0.406: v46.7,36.07 47.97,36.07 J1.P$9
  Bottom 0.406: v46.7,36.07 R1.1
N$17
  Top 0.203: D3.P$1 J7.2
N$18
  Top 0.203: D4.P$1 J8.2
N$19  (via drill 0.6)  (1 unrouted)
  Top 0.406: v46.7,28.45 47.97,28.45 48.89,29.37 J1.P$10
  Bottom 0.406: R7.1 v46.7,28.45
N$20  (via drill 0.6)
  Top 0.203: C4.2 23.28,25.15 v23.28,24.08 U2.P$1 | D4.P$2 v28.31,24.08 26.77,22.54 U2.P$10
  Bottom 0.203: v23.28,24.08 v28.31,24.08
N$25  (via drill 0.6)
  Top 0.406: v46.7,15.75 47.97,15.75 49.16,16.94 J1.P$8
  Bottom 0.406: R6.1 v46.7,15.75
N$26  (via drill 0.6)  (1 unrouted)
  Top 0.406: v46.7,13.21 47.97,13.21 48.35,13.59 J1.P$11
  Bottom 0.406: R8.1 v46.7,13.21
N$28
  Top 0.406: J2.P$11 1.36,33.82 R29.2
N$31
  Top 0.203: R22.2 U4.P$2
N$32
  Top 0.203: R23.2 12.59,48.76 12.85,48.51 U4.P$4
N$33
  Top 0.203: R24.2 R23.1 12.23,47.42 12.35,47.3 U4.P$5
PACK+  (via drill 0.6)
  Top 0.203: R19.2 v27.5,21.89 27.14,21.54 U2.P$8 | U2.P$5 22.66,20.54 v22.66,19.17 C5.1 | U3.P$3 7.57,30.19 U3.P$4 | 10.17,32.61 C1.1 10.28,33.31 14.57,36.91 14.8,38 14.8,42.82 14.35,43.27 U4.P$10 | U1.P$5 22.66,9.97 v22.66,8.61 | v22.66,8.61 C3.1 | R18.2 28.77,11.35 v27.5,11.35 27.12,10.97 U1.P$8 | 8.09,32.61 8.04,32.56 6.51,32.56 5.4,31.45 5.4,30.76 4.64,30.01 R14.1 4.64,28.3 3.77,27.43 R11.1 3.74,27.2 v2.83,27.2 | v22.66,8.61 11.7,8.61 8.96,11.35 J15.P$1 6.29,11.45 v6.29,12.22
  Top 0.381: 7.57,30.19 7.57,32.61 8.09,32.61 10.17,32.61
  Bottom 0.203: v27.5,11.35 27.5,8.61 v22.66,8.61 22.42,8.85 22.42,18.93 v22.66,19.17 27.5,19.17 v27.5,21.89 | v2.83,27.2 2.83,15.67 v6.29,12.22
PACK-  (via drill 0.6)
  Top 0.203: R16.2 7.12,16.63 R17.1 7.35,14.85 v7.71,14.85 | J15.P$2 7.86,10.35 v7.71,10.34
  Bottom 0.203: v7.71,10.34 v7.71,14.85
PS/SYNC-1
  Top 0.203: U1.P$7 R18.1 R31.2
PS/SYNC-2
  Top 0.203: U2.P$7 R19.1 R30.2
SCL  (via drill 0.6)
  Top 0.203: R12.1 10.74,29.47 11.32,30.05 | 11.32,30.05 11.71,30.05 11.76,30.05 16.04,30.05 J12.2 | U3.P$11 8.17,24.69 8.91,23.95 v10.36,23.95 | v10.42,30.05 11.32,30.05
  Bottom 0.203: v10.36,23.95 10.36,30.04 v10.42,30.05
SDA  (via drill 0.6)
  Top 0.203: J13.2 15.99,27.03 12.64,27.03 12.1,26.49 11.11,26.49 | 11.11,26.49 10.74,26.87 R13.1 | U3.P$10 7.77,23.09 v8.76,23.07 | v11.13,26.03 11.13,26.29 11.11,26.49
  Bottom 0.203: v8.76,23.07 11.13,23.07 11.13,24.26 v11.13,26.03
SELF_EN
  Top 0.203: J9.1 8.78,40.44 10.68,42.34 R25.1
SPI-CSB-SD  (via drill 0.6)
  Top 0.406: v46.7,33.53 47.97,33.53 48.01,33.57 J1.P$1
  Bottom 0.406: R2.1 v46.7,33.53
SPI-MISO-SD  (via drill 0.6)
  Top 0.406: J1.P$7 48.32,18.64 47.97,18.29 v46.7,18.29 45.3,19.69 v41.21,19.69
  Bottom 0.406: R5.1 v46.7,18.29 | v41.21,19.69 32.85,28.04 32.85,49.54 J4.10
SPI-MOSI-SD  (via drill 0.6)
  Top 0.406: J1.P$2 48.05,31.07 47.97,30.99 v46.7,30.99 45.38,30.99 43.22,33.15 43.22,39.12 35.34,46.99 35.34,49.59 J4.8
  Bottom 0.406: R3.1 v46.7,30.99
SPI-SCLK-SD  (via drill 0.6)
  Top 0.406: J1.P$5 48.17,23.57 47.97,23.37 v46.7,23.37 42.81,23.37 40.83,25.37 39.84,26.37 39.84,38.96 33.87,44.93 32.07,44.93 30.37,46.63 30.37,49.49 J4.12
  Bottom 0.406: R4.1 v46.7,23.37

### Text on the board
Top: TPS63002 | TPS63001